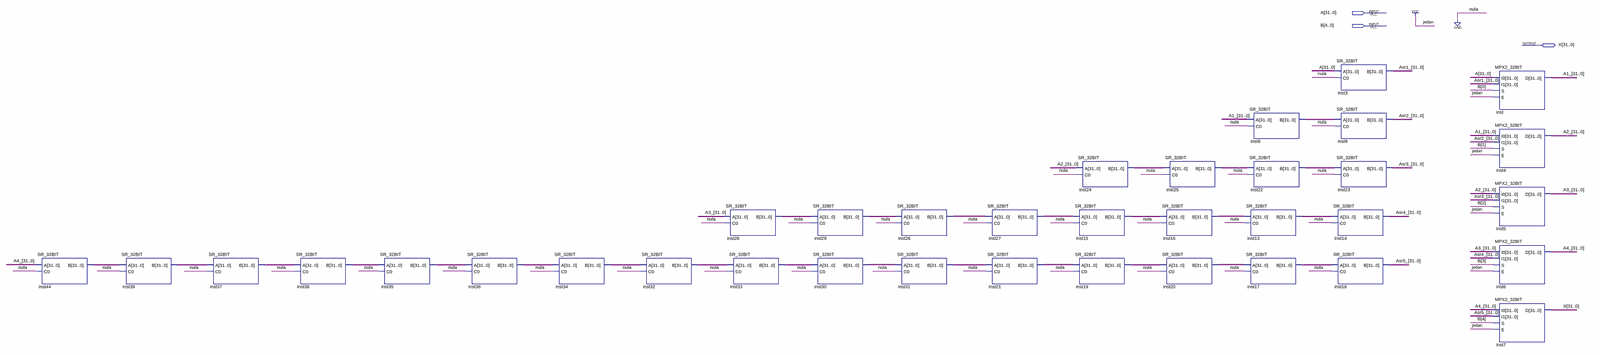
[diagram p0: schematic sheet, whole]
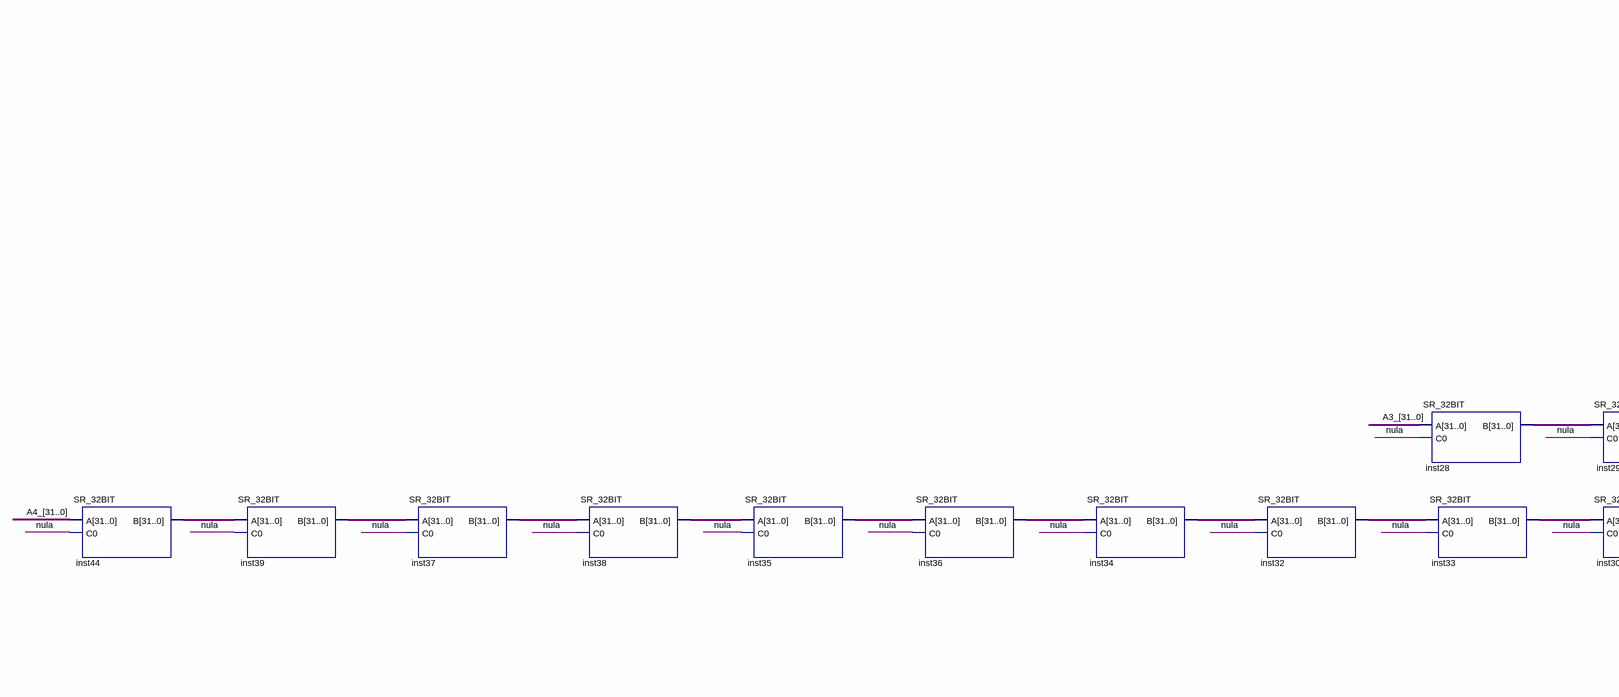
[diagram p1: schematic sheet, left part]
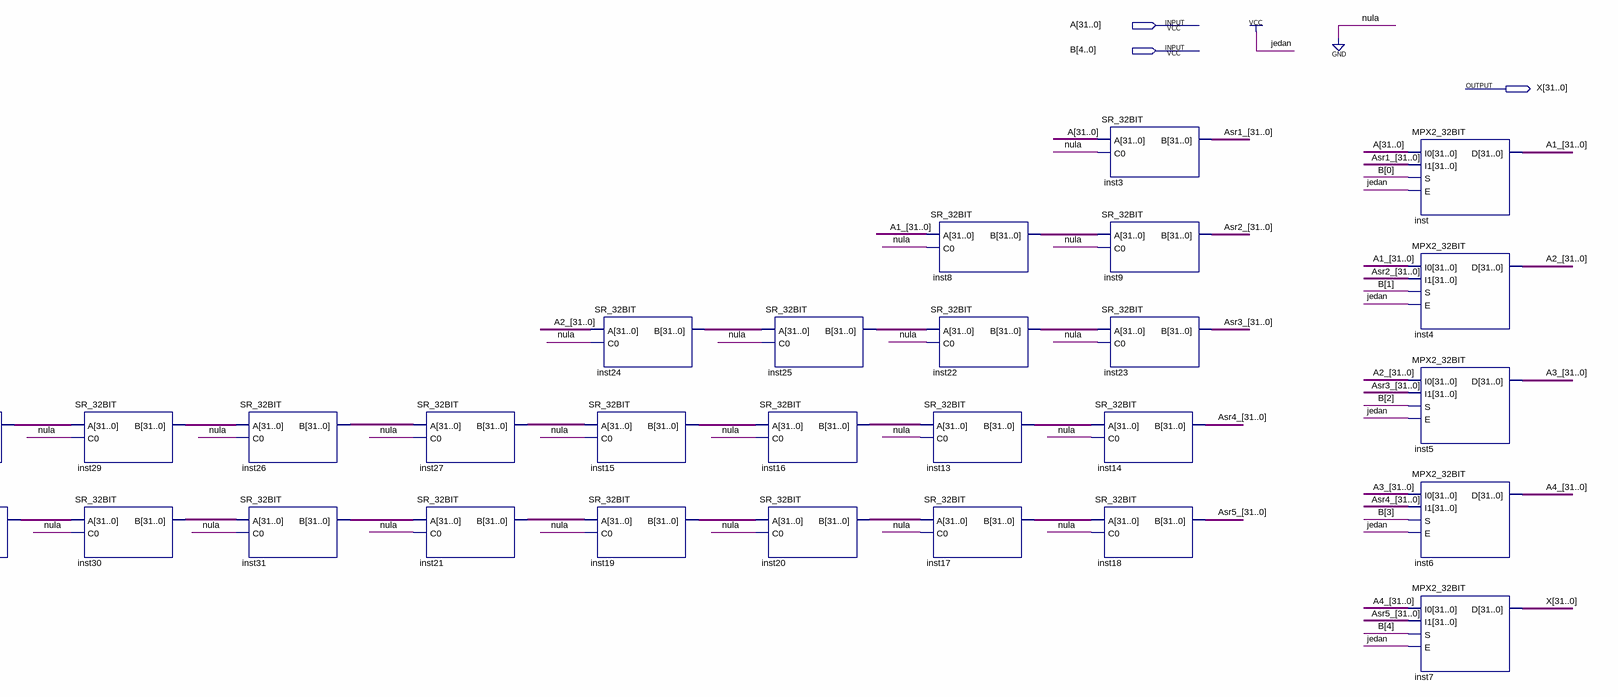
[diagram p2: schematic sheet, right part]
// Quartus schematic SR5_32BIT.bdf as structural Verilog: 36 symbols, 3 pins
module SR5_32BIT (
  input  [31:0] A,
  input  [4:0] B,
  output [31:0] X
);

  wire [31:0] A1_, A2_, A3_, A4_, Asr1_, Asr2_, Asr3_, Asr4_, Asr5_, inst8_b, inst13_b, inst15_b, inst16_b,
       inst17_b, inst19_b, inst20_b, inst21_b, inst22_b, inst24_b, inst25_b, inst26_b, inst27_b, inst28_b,
       inst29_b, inst30_b, inst31_b, inst32_b, inst33_b, inst34_b, inst35_b, inst36_b, inst37_b, inst38_b,
       inst39_b, inst44_b;

  SR_32BIT inst44 (.A(A4_), .C0(1'b0), .B(inst44_b));
  SR_32BIT inst39 (.A(inst44_b), .C0(1'b0), .B(inst39_b));
  SR_32BIT inst37 (.A(inst39_b), .C0(1'b0), .B(inst37_b));
  SR_32BIT inst38 (.A(inst37_b), .C0(1'b0), .B(inst38_b));
  SR_32BIT inst35 (.A(inst38_b), .C0(1'b0), .B(inst35_b));
  SR_32BIT inst36 (.A(inst35_b), .C0(1'b0), .B(inst36_b));
  SR_32BIT inst34 (.A(inst36_b), .C0(1'b0), .B(inst34_b));
  SR_32BIT inst32 (.A(inst34_b), .C0(1'b0), .B(inst32_b));
  SR_32BIT inst28 (.A(A3_), .C0(1'b0), .B(inst28_b));
  SR_32BIT inst33 (.A(inst32_b), .C0(1'b0), .B(inst33_b));
  SR_32BIT inst29 (.A(inst28_b), .C0(1'b0), .B(inst29_b));
  SR_32BIT inst30 (.A(inst33_b), .C0(1'b0), .B(inst30_b));
  SR_32BIT inst26 (.A(inst29_b), .C0(1'b0), .B(inst26_b));
  SR_32BIT inst31 (.A(inst30_b), .C0(1'b0), .B(inst31_b));
  SR_32BIT inst27 (.A(inst26_b), .C0(1'b0), .B(inst27_b));
  SR_32BIT inst21 (.A(inst31_b), .C0(1'b0), .B(inst21_b));
  SR_32BIT inst24 (.A(A2_), .C0(1'b0), .B(inst24_b));
  SR_32BIT inst15 (.A(inst27_b), .C0(1'b0), .B(inst15_b));
  SR_32BIT inst19 (.A(inst21_b), .C0(1'b0), .B(inst19_b));
  SR_32BIT inst25 (.A(inst24_b), .C0(1'b0), .B(inst25_b));
  SR_32BIT inst16 (.A(inst15_b), .C0(1'b0), .B(inst16_b));
  SR_32BIT inst20 (.A(inst19_b), .C0(1'b0), .B(inst20_b));
  SR_32BIT inst8 (.A(A1_), .C0(1'b0), .B(inst8_b));
  SR_32BIT inst22 (.A(inst25_b), .C0(1'b0), .B(inst22_b));
  SR_32BIT inst13 (.A(inst16_b), .C0(1'b0), .B(inst13_b));
  SR_32BIT inst17 (.A(inst20_b), .C0(1'b0), .B(inst17_b));
  SR_32BIT inst3 (.A(A), .C0(1'b0), .B(Asr1_));
  SR_32BIT inst9 (.A(inst8_b), .C0(1'b0), .B(Asr2_));
  SR_32BIT inst23 (.A(inst22_b), .C0(1'b0), .B(Asr3_));
  SR_32BIT inst14 (.A(inst13_b), .C0(1'b0), .B(Asr4_));
  SR_32BIT inst18 (.A(inst17_b), .C0(1'b0), .B(Asr5_));
  MPX2_32BIT inst (.I0(A), .I1(Asr1_), .S(B[0]), .E(1'b1), .D(A1_));
  MPX2_32BIT inst4 (.I0(A1_), .I1(Asr2_), .S(B[1]), .E(1'b1), .D(A2_));
  MPX2_32BIT inst5 (.I0(A2_), .I1(Asr3_), .S(B[2]), .E(1'b1), .D(A3_));
  MPX2_32BIT inst6 (.I0(A3_), .I1(Asr4_), .S(B[3]), .E(1'b1), .D(A4_));
  MPX2_32BIT inst7 (.I0(A4_), .I1(Asr5_), .S(B[4]), .E(1'b1), .D(X));
endmodule
